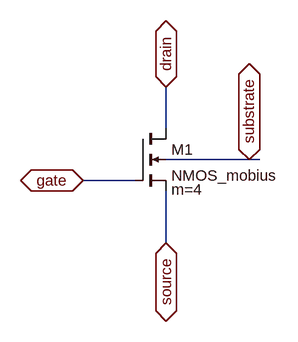
[diagram p0: schematic DP_nMOS_4x_B.asc]
DP_nMOS_4x_B.asc, the LTspice schematic file:
Version 4
SHEET 1 880 680
WIRE 288 192 288 128
WIRE 416 240 288 240
WIRE 432 240 416 240
WIRE 240 272 160 272
WIRE 288 368 288 288
FLAG 288 128 drain
IOPIN 288 128 BiDir
FLAG 288 368 source
IOPIN 288 368 BiDir
FLAG 160 272 gate
IOPIN 160 272 BiDir
FLAG 416 240 substrate
IOPIN 416 240 BiDir
SYMBOL nmos4 240 192 R0
WINDOW 123 56 94 Left 2
SYMATTR InstName M1
SYMATTR Value NMOS_mobius
SYMATTR Value2 m=4

The netlist it stands for:
* DP_nMOS_4x_B.asc
M1 drain gate source substrate NMOS_mobius m=4
.model NMOS NMOS
.model PMOS PMOS
.lib standard.mos
.backanno
.end